# EAGLE design cek pin 37 (EAGLE 9.6.2)
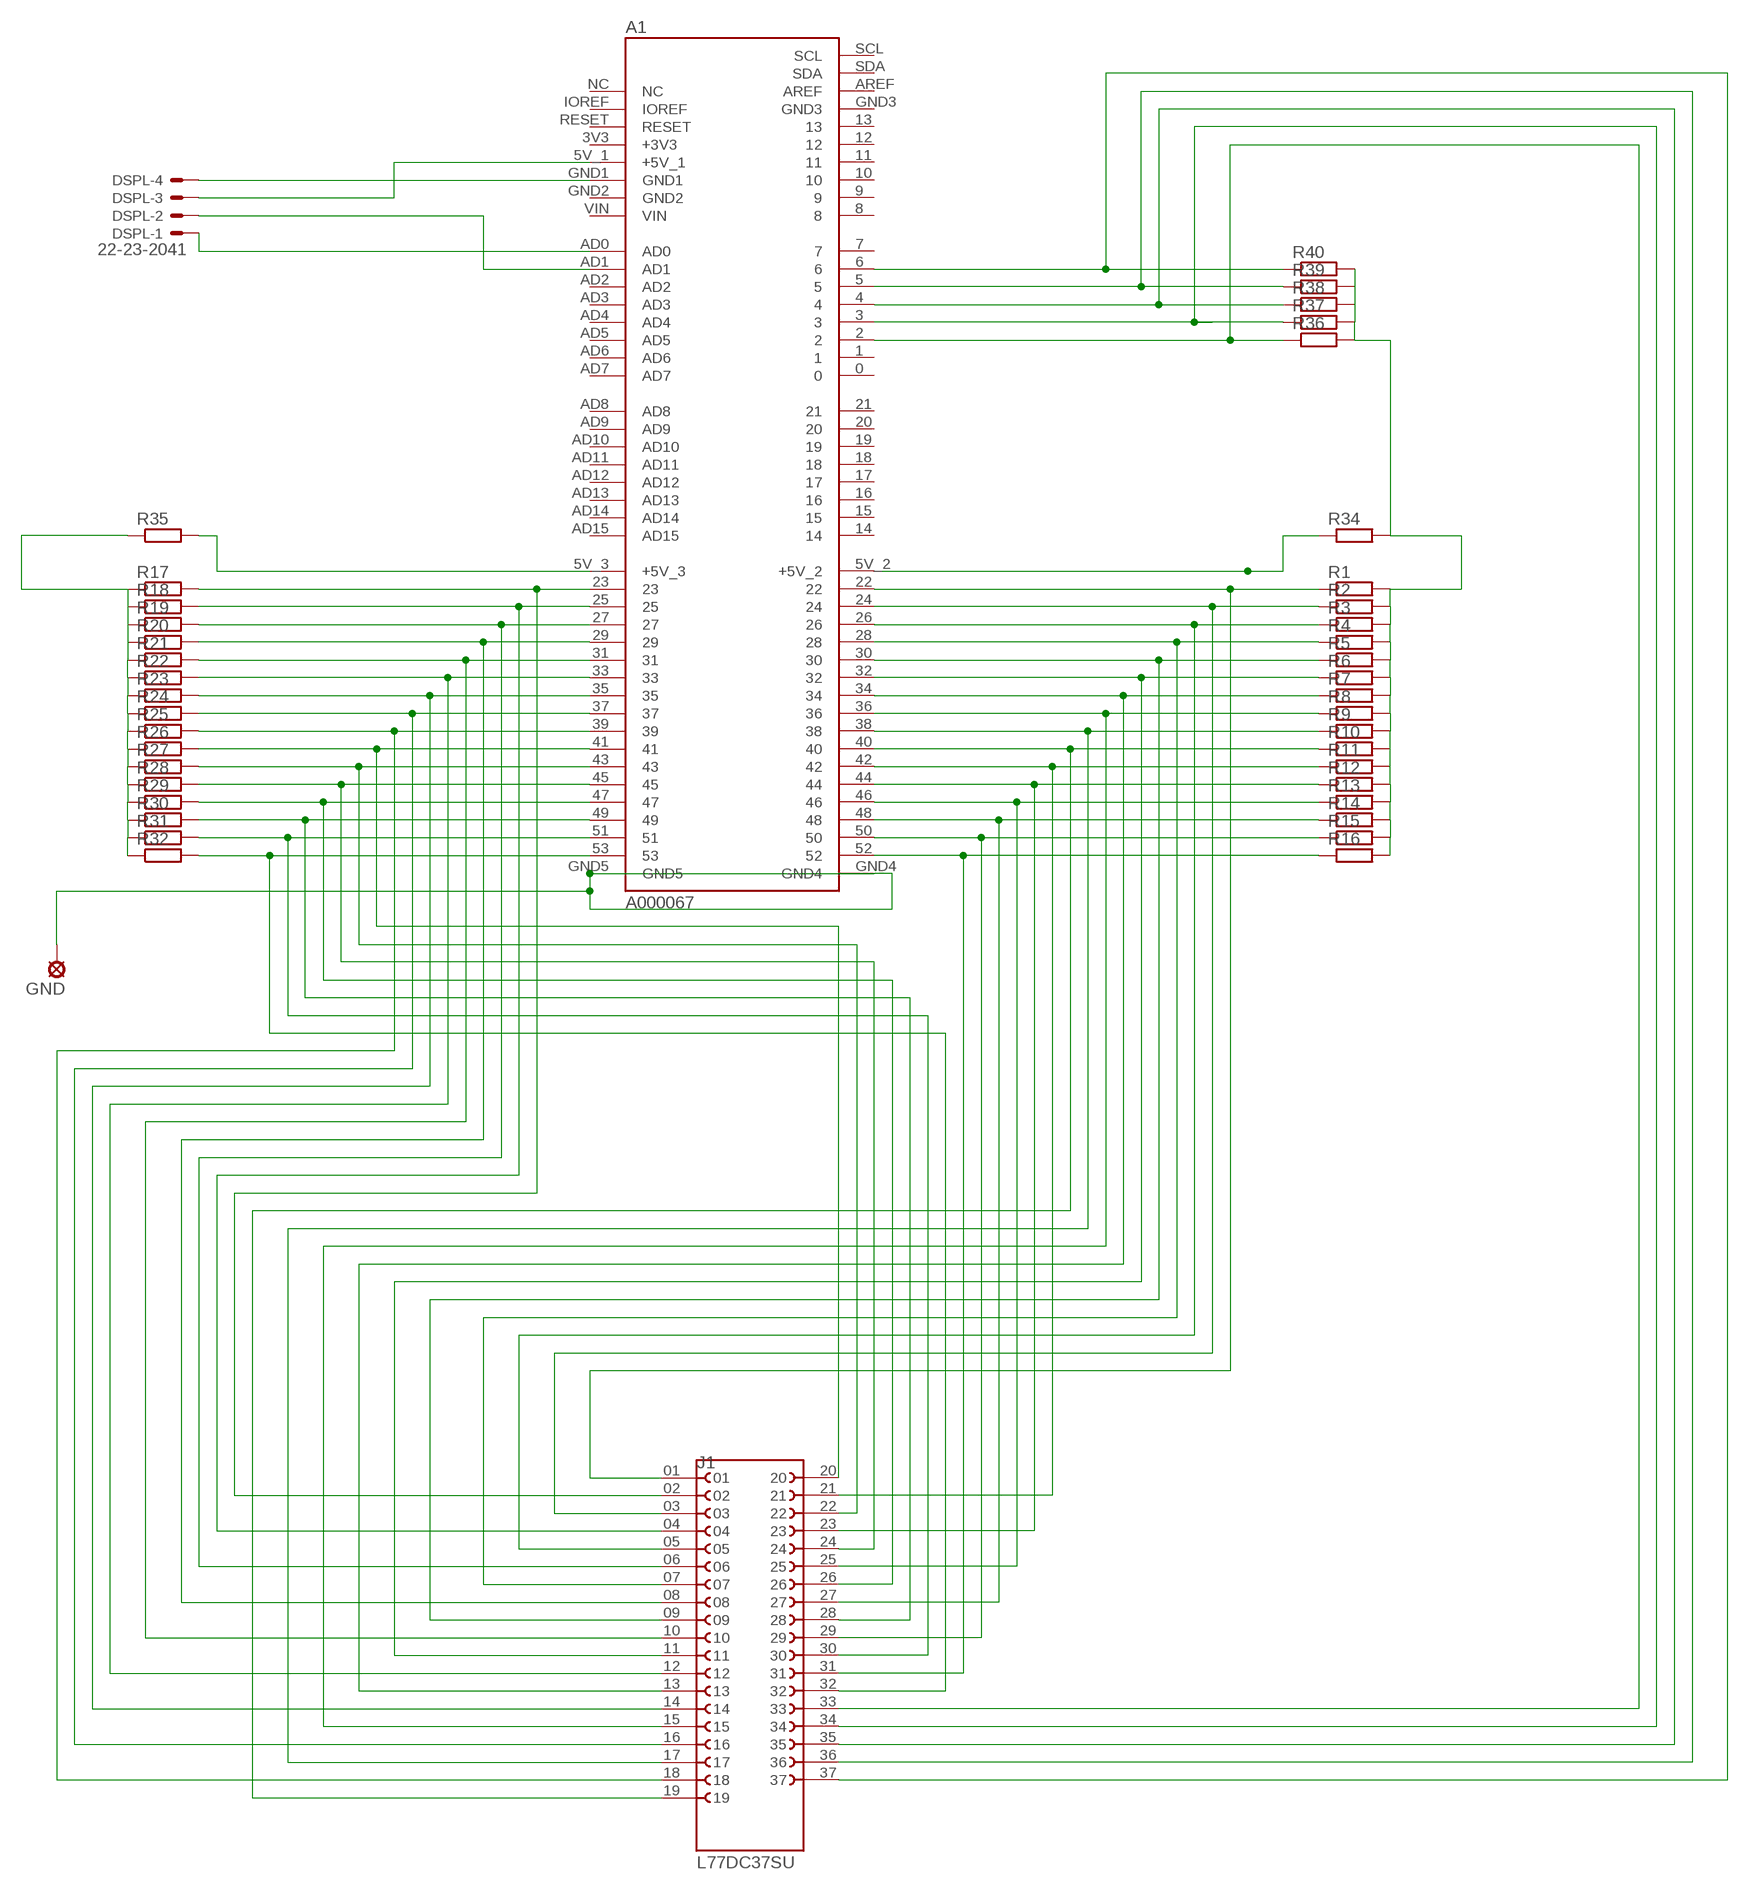
[diagram p0: schematic, sheet 1]

## Parts
A1  A000067  [ARDUINO_A000067]
DSPL  22-23-2041  [22-23-2041]
GND  LSP10  [LSP10]
J1  L77DC37SU  [AMPHENOL_L77DC37SU]
R1  R-EU_0207/12  [0207/12]
R2  R-EU_0207/12  [0207/12]
R3  R-EU_0207/12  [0207/12]
R4  R-EU_0207/12  [0207/12]
R5  R-EU_0207/12  [0207/12]
R6  R-EU_0207/12  [0207/12]
R7  R-EU_0207/12  [0207/12]
R8  R-EU_0207/12  [0207/12]
R9  R-EU_0207/12  [0207/12]
R10  R-EU_0207/12  [0207/12]
R11  R-EU_0207/12  [0207/12]
R12  R-EU_0207/12  [0207/12]
R13  R-EU_0207/12  [0207/12]
R14  R-EU_0207/12  [0207/12]
R15  R-EU_0207/12  [0207/12]
R16  R-EU_0207/12  [0207/12]
R17  R-EU_0207/12  [0207/12]
R18  R-EU_0207/12  [0207/12]
R19  R-EU_0207/12  [0207/12]
R20  R-EU_0207/12  [0207/12]
R21  R-EU_0207/12  [0207/12]
R22  R-EU_0207/12  [0207/12]
R23  R-EU_0207/12  [0207/12]
R24  R-EU_0207/12  [0207/12]
R25  R-EU_0207/12  [0207/12]
R26  R-EU_0207/12  [0207/12]
R27  R-EU_0207/12  [0207/12]
R28  R-EU_0207/12  [0207/12]
R29  R-EU_0207/12  [0207/12]
R30  R-EU_0207/12  [0207/12]
R31  R-EU_0207/12  [0207/12]
R32  R-EU_0207/12  [0207/12]
R34  R-EU_0207/12  [0207/12]
R35  R-EU_0207/12  [0207/12]
R36  R-EU_0207/12  [0207/12]
R37  R-EU_0207/12  [0207/12]
R38  R-EU_0207/12  [0207/12]
R39  R-EU_0207/12  [0207/12]
R40  R-EU_0207/12  [0207/12]

## Nets
N$1: A1.23 J1.02 R17.2
N$2: A1.25 J1.04 R18.2
N$3: A1.27 J1.06 R19.2
N$4: A1.29 J1.08 R20.2
N$5: A1.31 J1.10 R21.2
N$6: A1.33 J1.12 R22.2
N$7: A1.35 J1.14 R23.2
N$8: A1.37 J1.16 R24.2
N$9: A1.39 J1.18 R25.2
N$10: A1.41 J1.20 R26.2
N$11: A1.43 J1.22 R27.2
N$12: A1.45 J1.24 R28.2
N$13: A1.47 J1.26 R29.2
N$14: A1.49 J1.28 R30.2
N$15: A1.51 J1.30 R31.2
N$16: A1.53 J1.32 R32.2
N$17: A1.22 J1.01 R1.1
N$18: A1.24 J1.03 R2.1
N$19: A1.26 J1.05 R3.1
N$20: A1.28 J1.07 R4.1
N$21: A1.30 J1.09 R5.1
N$22: A1.32 J1.11 R6.1
N$23: A1.34 J1.13 R7.1
N$24: A1.36 J1.15 R8.1
N$25: A1.5V_1(+5V_1) DSPL.3
N$26: A1.GND1 DSPL.4
N$27: A1.AD1 DSPL.2
N$28: A1.44 J1.23 R12.1
N$29: A1.46 J1.25 R13.1
N$30: A1.48 J1.27 R14.1
N$31: A1.50 J1.29 R15.1
N$32: A1.52 J1.31 R16.1
N$33: A1.38 J1.17 R9.1
N$34: A1.5V_3(+5V_3) R35.2
N$35: A1.2 J1.33 R36.1
N$36: A1.AD0 DSPL.1
N$37: A1.4 J1.35 R38.1
N$38: A1.5 J1.36 R39.1
N$39: A1.6 J1.37 R40.1
N$40: R1.2 R2.2 R3.2 R4.2 R5.2 R6.2 R7.2 R8.2 R9.2 R10.2 R11.2 R12.2 R13.2 R14.2 R15.2 R16.2 R34.2 R36.2 R37.2 R38.2 R39.2 R40.2
N$41: R17.1 R18.1 R19.1 R20.1 R21.1 R22.1 R23.1 R24.1 R25.1 R26.1 R27.1 R28.1 R29.1 R30.1 R31.1 R32.1 R35.1
N$42: A1.5V_2(+5V_2) R34.1
N$43: A1.40 J1.19 R10.1
N$44: A1.42 J1.21 R11.1
N$45: A1.GND4 A1.GND5 GND.MP
N$48: A1.3 J1.34 R37.1
Unconnected: A1.0 A1.1 A1.3V3(+3V3) A1.7 A1.8 A1.9 A1.10 A1.11 A1.12 A1.13 A1.14 A1.15 A1.16 A1.17 A1.18 A1.19 A1.20 A1.21 A1.AD2 A1.AD3 A1.AD4 A1.AD5 A1.AD6 A1.AD7 A1.AD8 A1.AD9 A1.AD10 A1.AD11 A1.AD12 A1.AD13 A1.AD14 A1.AD15 A1.AREF A1.GND2 A1.GND3 A1.IOREF A1.NC A1.RESET A1.SCL A1.SDA A1.VIN

## Library data of the parts
A1 = A000067:A000067: ARDUINO UNO REV3 DEVELOPMENT BOARD Check availability <https://pricing.snapeda.com/parts/Arduino%20Mega%202560%20Rev3/Arduino/view-part?ref=eda>; AVAILABILITY: In Stock; CHECK_PRICES: https://www.snapeda.com/parts/Arduino%20Mega%202560%20Rev3/Arduino/view-part/?ref=eda; DESCRIPTION: 8-bit board with 54 digital pins, 16 analog inputs, and 4 serial ports.; MF: Arduino; MP: Arduino Mega 2560 Rev3; PACKAGE: Non-Standard Arduino; PRICE: None; SNAPEDA_LINK: https://www.snapeda.com/parts/Arduino%20Mega%202560%20Rev3/Arduino/view-part/?ref=snap
DSPL = con-molex:22-23-2041: .100" (2.54mm) Center Header - 4 Pin; MF: MOLEX; MPN: 22-23-2041; OC_FARNELL: 1462920; OC_NEWARK: 38C0355
GND = solpad:LSP10: SOLDER PAD drill 1.0 mm, distributor Buerklin, 12H555
J1 = L77DC37SU:L77DC37SU: Check availability <https://pricing.snapeda.com/parts/L77-DC37S-U/Amphenol%20Commercial%20Products/view-part?ref=eda>; AVAILABILITY: In Stock; CHECK_PRICES: https://www.snapeda.com/parts/L77-DC37S-U/Amphenol/view-part/?ref=eda; DESCRIPTION: Connector d-sub pcb dip solder 0.024 dia pcb cont 37 socket contact receptacle | Amphenol Commercial (Amphenol CS) L77-DC37S-U; MF: Amphenol Commercial Products; MP: L77-DC37S-U; PACKAGE: None; PRICE: None; SNAPEDA_LINK: https://www.snapeda.com/parts/L77-DC37S-U/Amphenol/view-part/?ref=snap
R1-R32 R34-R40 = rcl:R-EU_: RESISTOR, European symbol; SPICEPREFIX: R

## Board
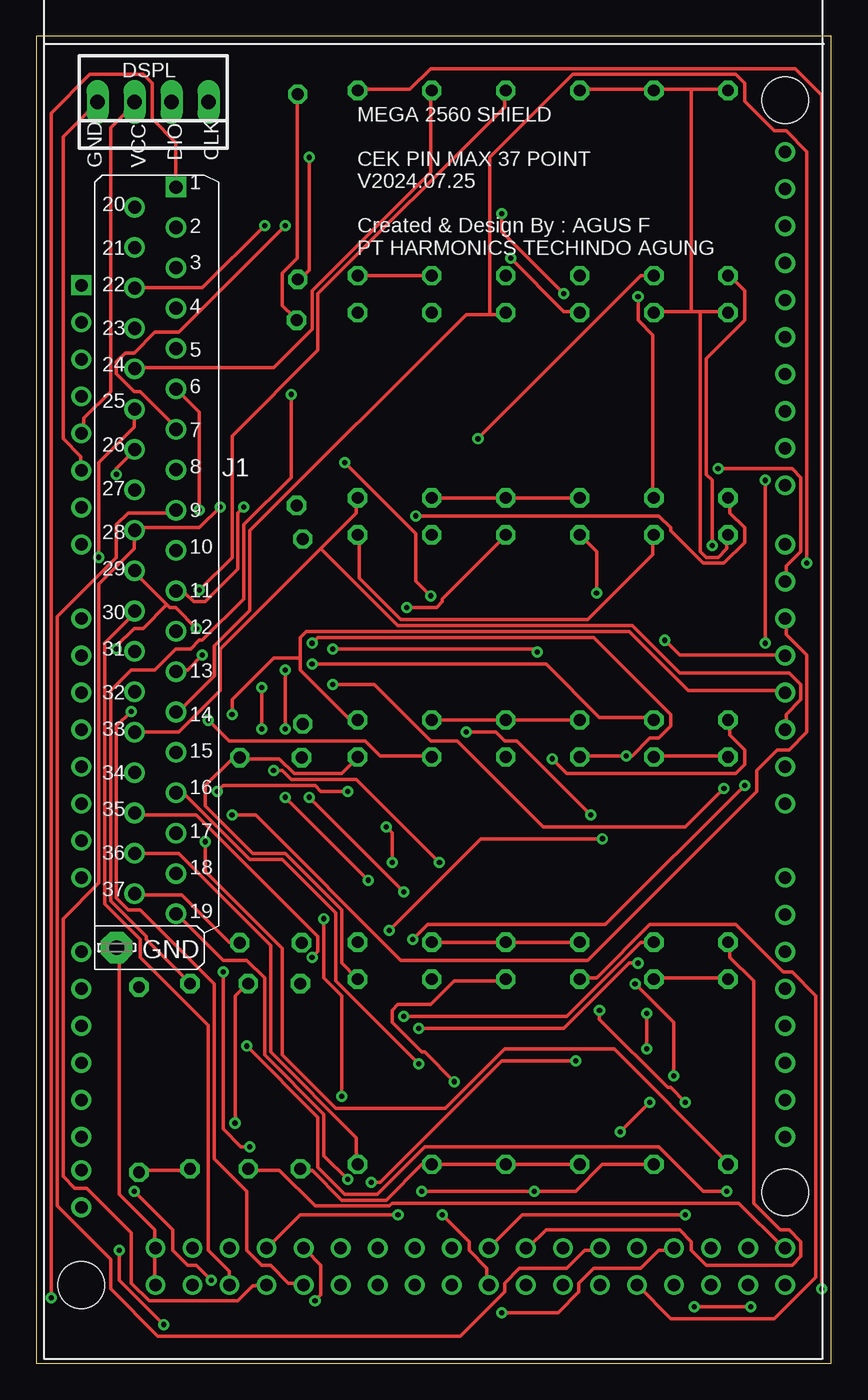
[diagram p1: board, top side]
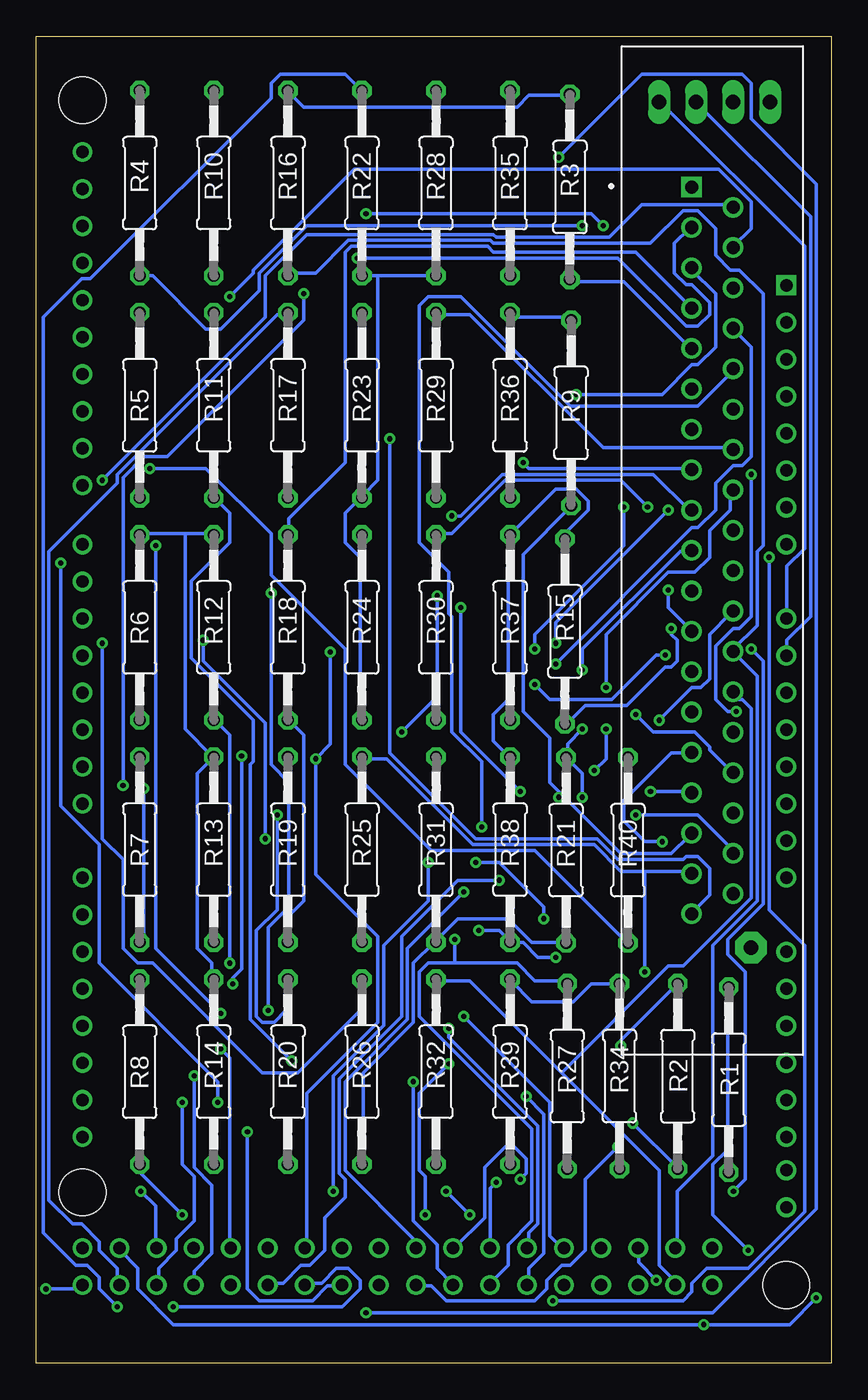
[diagram p2: board, bottom side, seen from below]

Size 54.5 x 91 mm. Coordinates in mm from the lower left corner, seen from the top.
Outline: 0,0 54.5,0 54.5,91 0,91 0,0
Copper layers (1*16): Top 0.035mm / dielectric 1.5mm / Bottom 0.035mm
Design rules "default *": minimum track width 10mil, minimum drill 0.35mm, track to track 6mil, track to pad 10mil, pad to pad 6mil, via to via 20mil, smd to smd 6mil, copper to edge 10mil, drill to drill 10mil, minimum pad ring 10mil, minimum via ring 8mil, stop-mask expansion 4mil, vias tented up to drill 0mil, thermal gap 10mil

### Footprints (pad centres in the part's own frame; a part is rotated, then mirrored left to right if it is on the bottom)
ARDUINO_A000067 = drill 0.85: 0 24.13,-12.7; 1 24.13,-10.16; 2 24.13,-7.62; 3 24.13,-5.08; 3V3 -24.13,15.24; 4 24.13,-2.54; 5 24.13,0; 5V_1 -24.13,12.7; 5V_2 24.13,-43.18; 5V_3 24.13,-45.72; 6 24.13,2.54; 7 24.13,5.08; 8 24.13,9.144; 9 24.13,11.684; 10 24.13,14.224; 11 24.13,16.764; 12 24.13,19.304; 13 24.13,21.844; 14 24.13,-17.78; 15 24.13,-20.32; 16 24.13,-22.86; 17 24.13,-25.4; 18 24.13,-27.94; 19 24.13,-30.48; 20 24.13,-33.02; 21 24.13,-35.56; 22 21.59,-43.18; 23 21.59,-45.72; 24 19.05,-43.18; 25 19.05,-45.72; 26 16.51,-43.18; 27 16.51,-45.72; 28 13.97,-43.18; 29 13.97,-45.72; 30 11.43,-43.18; 31 11.43,-45.72; 32 8.89,-43.18; 33 8.89,-45.72; 34 6.35,-43.18; 35 6.35,-45.72; 36 3.81,-43.18; 37 3.81,-45.72; 38 1.27,-43.18; 39 1.27,-45.72; 40 -1.27,-43.18; 41 -1.27,-45.72; 42 -3.81,-43.18; 43 -3.81,-45.72; 44 -6.35,-43.18; 45 -6.35,-45.72; 46 -8.89,-43.18; 47 -8.89,-45.72; 48 -11.43,-43.18; 49 -11.43,-45.72; 50 -13.97,-43.18; 51 -13.97,-45.72; 52 -16.51,-43.18; 53 -16.51,-45.72; AD0 -24.13,0; AD1 -24.13,-2.54; AD2 -24.13,-5.08; AD3 -24.13,-7.62; AD4 -24.13,-10.16; AD5 -24.13,-12.7; AD6 -24.13,-15.24; AD7 -24.13,-17.78; AD8 -24.13,-22.86; AD9 -24.13,-25.4; AD10 -24.13,-27.94; AD11 -24.13,-30.48; AD12 -24.13,-33.02; AD13 -24.13,-35.56; AD14 -24.13,-37.846; AD15 -24.13,-40.386; AREF 24.13,26.924; GND1 -24.13,10.16; GND2 -24.13,7.62; GND3 24.13,24.384; GND4 -19.05,-43.18; GND5 -19.05,-45.72; IOREF -24.13,20.32; RESET -24.13,17.78; SCL 24.13,32.004; SDA 24.13,29.464; VIN -24.13,5.08 | drill 0.85 square: NC -24.13,22.86 | hole 3.2: 24.13,35.56; -24.13,-45.72; 24.13,-39.37
22-23-2041 = drill 1 long: 1 -3.81,0; 2 -1.27,0; 3 1.27,0; 4 3.81,0
LSP10 = drill 1.016 pad 2.159 octagon: MP 0,0
AMPHENOL_L77DC37SU = drill 0.9 square: 01 24.93,1.42 | drill 0.9: 02 22.16,1.42; 03 19.39,1.42; 04 16.62,1.42; 05 13.85,1.42; 06 11.08,1.42; 07 8.31,1.42; 08 5.54,1.42; 09 2.77,1.42; 10 0,1.42; 11 -2.77,1.42; 12 -5.54,1.42; 13 -8.31,1.42; 14 -11.08,1.42; 15 -13.85,1.42; 16 -16.62,1.42; 17 -19.39,1.42; 18 -22.16,1.42; 19 -24.93,1.42; 20 23.545,-1.42; 21 20.775,-1.42; 22 18.005,-1.42; 23 15.235,-1.42; 24 12.465,-1.42; 25 9.695,-1.42; 26 6.925,-1.42; 27 4.155,-1.42; 28 1.385,-1.42; 29 -1.385,-1.42; 30 -4.155,-1.42; 31 -6.925,-1.42; 32 -9.695,-1.42; 33 -12.465,-1.42; 34 -15.235,-1.42; 35 -18.005,-1.42; 36 -20.775,-1.42; 37 -23.545,-1.42
0207/12 = drill 0.813 octagon: 1 -6.35,0; 2 6.35,0

### Placement (x,y rotation side)
A1  27.21,51.07 0 top
DSPL  8,86.5 180 top
GND  5.5,28.5 0 top
J1  8.15,55.74 90 bottom
R1  7.03,19.44 270 bottom
R2  10.53,19.68 270 bottom
R3  17.92,80.68 90 bottom
R4  47.42,80.94 90 bottom
R5  47.42,65.7 90 bottom
R6  47.42,50.46 90 bottom
R7  47.42,35.22 90 bottom
R8  47.42,19.98 90 bottom
R9  17.84,65.18 90 bottom
R10  42.34,80.94 90 bottom
R11  42.34,65.7 90 bottom
R12  42.34,50.46 90 bottom
R13  42.34,35.22 90 bottom
R14  42.34,19.98 90 bottom
R15  18.26,50.18 90 bottom
R16  37.26,80.94 90 bottom
R17  37.26,65.7 90 bottom
R18  37.26,50.46 90 bottom
R19  37.26,35.22 90 bottom
R20  37.26,19.98 90 bottom
R21  18.18,35.18 90 bottom
R22  32.18,80.94 90 bottom
R23  32.18,65.7 90 bottom
R24  32.18,50.46 90 bottom
R25  32.18,35.22 90 bottom
R26  32.18,19.98 90 bottom
R27  18.1,19.68 90 bottom
R28  27.1,80.94 90 bottom
R29  27.1,65.7 90 bottom
R30  27.1,50.46 90 bottom
R31  27.1,35.22 90 bottom
R32  27.1,19.98 90 bottom
R34  14.52,19.68 90 bottom
R35  22.02,80.94 90 bottom
R36  22.02,65.7 90 bottom
R37  22.02,50.46 90 bottom
R38  22.02,35.22 90 bottom
R39  22.02,19.98 90 bottom
R40  13.94,35.18 90 bottom

### Tracks (layer width: path | path; a pad name or v marks a point on that pad's centre or on a via)
N$1  (via drill 0.35)
  Top 0.254: v32.51,75.79 36.17,72.14 37.19,72.14 R17.2
  Bottom 0.254: v32.51,75.79 14.63,75.79 9.96,71.12 9.14,71.12 8.33,71.93 8.33,72.75 9.55,73.97 9.96,73.97 10.77,74.78 10.77,76.81 9.75,77.83 J1.02 | A1.23 48.97,5.49 48.97,6.5 50.19,7.72 50.19,8.33 51.41,9.55 52.02,9.55 53.65,11.18 53.65,55.68 48.97,60.35 48.97,60.96 38,71.93 37.39,71.93 R17.2
N$2  (via drill 0.35)
  Top 0.254: v44.5,17.88 43.48,18.9 43.28,18.9 38.61,23.57 v38.61,24.18 | v38.41,52.83 38.41,55.68 37.39,56.69 R18.2
  Bottom 0.254: R18.2 37.19,56.9 37.19,57.91 33.33,61.77 33.33,76.2 32.92,76.61 23.57,76.61 23.16,76.2 13.41,76.2 9.75,72.54 J1.04 | v44.5,17.88 44.5,13.61 43.69,12.8 43.69,9.75 44.91,8.53 44.91,7.72 46.13,6.5 46.13,5.49 A1.25 | v38.61,24.18 38.61,29.87 37.19,31.29 37.19,39.83 38.41,41.05 v38.41,52.83
N$3  (via drill 0.35)
  Top 0.254: v18.9,49.38 19.3,49.78 38.2,49.78 43.48,44.5 43.48,43.69 42.67,42.88 42.06,42.88 40.84,41.66 v40.44,41.66 37.39,41.66 R19.2 | v11.18,58.52 11.18,65.23 9.75,66.65 J1.06 | v43.69,19.71 43.69,23.37 v41.05,26.01
  Bottom 0.254: v18.9,49.38 18.9,50.8 v11.18,58.52 | v43.69,19.71 43.69,13.41 42.47,12.19 42.47,7.52 43.69,6.3 43.69,5.49 A1.27 | v41.05,26.01 41.05,26.42 40.44,27.03 v40.44,41.66
N$4  (via drill 0.35)
  Top 0.254: R20.2 37.39,26.42 38.41,26.42 42.06,30.07 47.95,30.07 51.21,26.82 51.82,26.82 53.44,25.2 53.44,5.89 50.6,3.05 43.48,3.05 41.25,5.28 A1.29 | v21.13,61.77 26.01,56.9 26.01,53.65 v27.03,52.63 | v29.46,43.28 31.5,43.28 32.11,42.67 32.92,42.67 v38,37.59
  Bottom 0.254: v21.13,61.77 20.73,61.37 9.75,61.37 J1.08 | v27.03,52.63 27.03,45.72 v29.46,43.28 | v38,37.59 38,31.09 39.42,29.67 39.42,23.77 39.01,23.37 38.2,23.37 37.39,24.18 37.39,26.21 R20.2
N$5  (via drill 0.35)
  Top 0.254: v17.07,47.55 v17.07,43.48 | v17.07,38.81 v22.76,33.12
  Bottom 0.254: v17.07,43.48 18.09,42.47 18.09,41.66 R21.2 18.09,41.45 17.07,40.44 v17.07,38.81 | v17.07,47.55 17.07,48.97 10.36,55.68 9.75,55.68 J1.10 | v22.76,33.12 25.6,33.12 29.46,29.26 29.46,23.77 33.73,19.51 33.73,13.01 33.33,12.6 33.33,11.38 34.75,9.96 34.75,7.72 35.76,6.71 36.37,6.71 37.59,5.49 38.61,5.49 A1.31
N$6  (via drill 0.35)
  Top 0.254: v11.18,53.03 13.41,55.27 13.41,63.6 19.3,69.49 19.3,73.36 32.11,86.16 32.11,87.17 R22.2 | v48.97,3.86 v45.11,3.86
  Bottom 0.254: v11.18,53.03 11.18,51.82 9.75,50.39 J1.12 | v45.11,3.86 33.53,3.86 32.31,5.08 32.31,5.69 33.12,6.5 33.93,6.5 34.95,5.49 35.97,5.49 A1.33 | v48.97,3.86 50.19,5.08 50.19,5.89 51,6.71 51.82,6.71 54.05,8.94 54.05,71.73 51.41,74.37 50.8,74.37 38.41,86.77 38.41,87.78 37.8,88.39 33.33,88.39 32.31,87.38 R22.2
N$7  (via drill 0.35)
  Top 0.254: 31.09,71.93 29.46,71.93 14.63,57.1 14.63,51.61 12.19,49.17 12.19,47.14 9.75,44.7 J1.14 | 31.09,71.93 32.11,71.93 R23.2 | v42.06,17.88 v40.03,15.85 | v52.83,54.86 52.83,83.11 51.41,84.53 50.6,84.53 48.56,86.56 48.56,87.78 47.95,88.39 36.78,88.39 31.09,82.7 31.09,71.93
  Bottom 0.254: v40.03,15.85 40.03,5.08 39.22,4.27 35.56,4.27 34.54,5.28 33.73,5.28 A1.35 | v42.06,17.88 42.06,19.3 50.19,27.43 50.19,35.56 52.83,38.2 v52.83,54.86
N$8  (via drill 0.35)
  Top 0.254: v25.4,51.82 27.43,51.82 27.84,52.22 27.84,52.43 32.11,56.69 R24.2 | v21.34,39.22 19.51,39.22 19.1,39.62 12.8,39.62 v12.39,39.22 | v27.84,10.16 29.67,8.33 29.67,7.72 30.89,6.5 30.89,5.49 A1.37 | v26.21,20.52 20.52,26.21 20.52,30.89 16.87,34.54 14.63,34.54 10.16,39.01 9.75,39.01 J1.16
  Bottom 0.254: v25.4,51.82 25.4,43.28 v21.34,39.22 | v12.39,39.22 9.75,39.22 J1.16 | v27.84,10.16 27.84,12.8 28.25,13.21 28.25,18.49 v26.21,20.52
N$9  (via drill 0.35)
  Top 0.254: v14.63,14.83 14.02,14.83 12.8,16.05 v12.8,26.82
  Bottom 0.254: 12.8,33.73 9.75,33.73 J1.18 | 12.8,33.73 14.43,33.73 16.26,35.56 24.59,35.56 30.48,41.45 32.11,41.45 R25.2 | v14.63,14.83 16.87,12.6 16.87,7.72 17.88,6.71 18.49,6.71 19.51,5.69 19.51,5.08 20.32,4.27 26.42,4.27 27.43,5.28 28.45,5.28 A1.39 | 12.8,33.73 v12.8,26.82
N$10  (via drill 0.35)
  Top 0.254: v28.65,19.3 26.62,21.34 26.42,21.34 24.38,23.37 24.38,24.18 24.79,24.59 27.03,24.59 28.65,26.21 32.11,26.21 R26.2 | v49.99,49.38 v49.99,60.55
  Bottom 0.254: v28.65,19.3 28.65,9.75 27.03,8.13 27.03,6.5 26.01,5.49 A1.41 | v49.99,60.55 38.81,71.73 38.81,74.57 35.97,77.42 23.16,77.42 22.96,77.22 15.24,77.22 13.01,79.45 6.91,79.45 J1.20 | v49.99,49.38 49.99,35.97 48.56,34.54 48.56,28.45 47.55,27.43 46.53,27.43 39.01,19.91 36.58,19.91 32.31,24.18 32.31,26.21 R26.2
N$11  (via drill 0.35)
  Top 0.254: v15.65,78.03 11.38,73.76 6.91,73.76 J1.22 | v31.9,78.84 31.9,77.62 v36.17,73.36 | v48.56,39.62 39.01,30.07 26.82,30.07 v25.81,29.06
  Bottom 0.254: 25.81,27.43 27.64,27.43 28.25,26.82 28.25,23.77 20.52,16.05 20.52,9.75 22.15,8.13 22.15,6.71 23.37,5.49 A1.43 | 25.81,27.43 21.54,27.43 20.32,26.21 18.29,26.21 R27.2 | v15.65,78.03 16.46,78.84 v31.9,78.84 | v36.17,73.36 36.17,71.53 45.52,62.18 47.14,62.18 48.56,60.76 v48.56,39.62 | 25.81,27.43 v25.81,29.06
N$12  (via drill 0.35)
  Top 0.254: R28.2 27.03,87.17 27.03,81.69 18.9,73.56 18.9,70.92 16.26,68.28 6.91,68.28 J1.24 | v20.93,18.29 20.93,25.2 19.71,26.42 v19.71,30.48 | v24.38,34.34 24.38,36.37 v23.98,36.78
  Bottom 0.254: v20.93,18.29 19.71,17.07 19.71,7.52 20.73,6.5 20.73,5.49 A1.45 | v19.71,30.48 19.71,31.29 22.76,34.34 v24.38,34.34 | v23.98,36.78 23.98,41.25 26.01,43.28 26.01,51.21 26.21,51.41 26.21,54.25 28.25,56.29 28.25,72.54 27.64,73.15 25.4,73.15 17.88,65.63 9.14,65.63 6.71,68.07 J1.24
N$13  (via drill 0.35)
  Top 0.254: v6.5,44.7 5.49,43.69 5.49,31.9 6.3,31.09 7.11,31.09 12.19,26.01 12.19,14.02 14.43,11.79 14.43,7.72 15.44,6.71 16.05,6.71 17.27,5.49 18.29,5.49 A1.47 | v5.49,60.96 5.49,61.37 6.71,62.59 J1.26
  Bottom 0.254: R29.2 27.03,71.93 24.79,71.93 15.65,62.79 6.91,62.79 J1.26 | v6.5,44.7 7.11,44.7 7.92,45.52 7.92,49.17 6.71,50.39 6.3,50.39 5.49,51.21 v5.49,60.96
N$14  (via drill 0.35)
  Top 0.254: v12.6,58.73 11.18,57.3 6.91,57.3 J1.28 6.71,57.1 6.71,55.88 4.27,53.44 4.27,32.92 1.83,30.48 1.83,12.8 2.64,11.99 3.45,11.99 6.5,8.94 6.5,5.49 7.72,4.27 13.82,4.27 14.83,5.28 15.65,5.28 A1.49
  Bottom 0.254: v12.6,58.73 14.43,60.55 22.35,60.55 26.01,56.9 27.03,56.9 R30.2
N$15  (via drill 0.35)
  Top 0.254: v11.79,44.09 13.21,42.67 22.55,42.67 23.57,41.66 27.03,41.66 R31.2 | A1.51 13.21,5.49 13.21,6.3 11.79,7.72 11.79,23.16 7.11,27.84 7.11,29.06 4.67,31.5 4.67,49.38 6.71,51.41 J1.30
  Bottom 0.254: v11.79,44.09 9.55,46.33 8.94,46.33 8.33,46.94 8.33,49.99 6.91,51.41 J1.30
N$16
  Bottom 0.254: 18.49,19.91 11.79,13.21 11.79,6.71 10.57,5.49 A1.53 | 18.49,19.91 24.79,26.21 27.03,26.21 R32.2 | 18.49,19.91 11.18,27.23 10.16,27.23 5.49,31.9 5.49,44.91 6.1,45.52 6.3,45.52 6.71,45.92 J1.32
N$17  (via drill 0.35)
  Top 0.254: v5.69,7.72 5.69,5.69 v8.74,2.64 | v1.02,4.47 1.02,85.75 3.66,88.39 7.32,88.39 7.92,87.78 7.92,85.34 9.55,83.72 9.55,80.67 J1.01
  Bottom 0.254: v5.69,7.72 8.13,10.16 8.13,13.61 7.11,14.63 7.11,25.6 R1.1 | A1.22 48.77,7.72 47.55,6.5 47.55,5.08 45.11,2.64 v8.74,2.64 2.85,2.64 v1.02,4.47
N$18  (via drill 0.35)
  Top 0.254: v17.48,66.45 17.48,60.76 14.22,57.51 14.22,52.43 11.38,49.58 11.18,49.58 10.57,48.97 9.55,48.97 8.13,47.55 6.5,47.55 5.08,46.13 5.08,31.7 7.52,29.26 7.52,29.06 10.36,26.21 R2.1 | v47.35,11.79 45.72,11.79 42.67,14.83 26.62,14.83 23.37,11.58 21.13,11.58 19.3,13.41 19.3,16.87 v14.43,21.74
  Bottom 0.254: v17.48,66.45 11.58,66.45 9.55,68.48 9.14,68.48 7.92,69.7 7.92,73.36 9.55,74.98 J1.03 | v47.35,11.79 46.33,10.77 46.33,7.92 A1.24 | v14.43,21.74 14.43,22.15 10.57,26.01 R2.1
N$19  (via drill 0.35)
  Top 0.254: v31.9,3.45 35.76,3.45 37.19,4.88 37.19,5.49 38.2,6.5 41.45,6.5 42.67,7.72 43.69,7.72 A1.26 | v18.69,82.7 18.69,74.98 18.09,74.37 R3.1
  Bottom 0.254: R3.1 17.88,74.17 14.22,74.17 9.75,69.7 J1.05 | v31.9,3.45 8.13,3.45 1.02,10.57 1.02,80.87 5.49,85.34 5.49,87.78 6.1,88.39 13.01,88.39 v18.69,82.7
N$20  (via drill 0.35)
  Top 0.254: v17.07,78.03 9.75,70.71 8.13,70.71 6.71,69.29 6.1,69.29 5.49,68.68 5.49,67.87 6.71,66.65 7.11,66.65 9.55,64.21 J1.07 | v41.86,23.98 v41.86,21.54 | v46.33,56.08 46.33,60.55 45.92,60.96 45.92,68.89 48.56,71.53 48.56,73.56 47.55,74.57 R4.1
  Bottom 0.254: v17.07,78.03 35.97,78.03 39.22,74.78 39.22,73.56 41.86,70.92 42.88,70.92 46.53,74.57 47.35,74.57 R4.1 | v41.86,21.54 41.25,20.93 41.25,7.92 A1.28 | v41.86,23.98 46.33,28.45 v46.33,56.08
N$21  (via drill 0.35)
  Top 0.254: v26.01,58.12 42.67,58.12 43.48,57.3 43.48,57.1 45.72,54.86 47.14,54.86 48.56,56.29 48.56,57.3 47.55,58.32 47.55,59.33 R5.1 | A1.30 38.61,7.72 37.59,7.72 36.37,6.5 33.12,6.5 32.11,5.49 32.11,4.88 29.06,1.83 8.33,1.83 5.08,5.08 5.08,7.11 1.42,10.77 1.42,51.21 5.49,55.27 5.49,57.51 6.3,58.32 9.55,58.32 J1.09
  Bottom 0.254: v26.01,58.12 25.4,58.12 22.55,60.96 12.19,60.96 9.75,58.52 J1.09
N$22  (via drill 0.35)
  Top 0.254: v35.36,41.45 36.37,40.44 47.95,40.44 48.56,41.05 48.56,42.06 47.55,43.08 47.55,44.09 R6.1 | v14.22,58.73 13.82,58.32 13.82,54.46 11.58,52.22 10.77,52.22 10.16,52.83 9.75,52.83 J1.11 | v20.32,48.97 34.14,48.97 v34.34,48.77
  Bottom 0.254: A1.32 35.97,7.92 35.97,18.49 31.09,23.37 31.09,29.26 35.36,33.53 v35.36,41.45 34.34,42.47 v34.34,48.77 | v14.22,58.73 14.22,56.08 20.32,49.99 v20.32,48.97
N$23  (via drill 0.35)
  Top 0.254: R7.1 47.55,28.85 47.55,27.84 49.17,26.21 49.17,10.97 51,9.14 51.61,9.14 52.43,8.33 52.43,7.32 51.82,6.71 45.92,6.71 44.91,7.72 44.91,8.33 44.09,9.14 34.95,9.14 33.73,7.92 A1.34 | v11.38,48.56 10.36,47.55 9.75,47.55 J1.13 | v20.32,46.53 23.16,46.53 27.03,42.67 28.85,42.67 34.75,36.78 44.5,36.78 v47.14,39.42
  Bottom 0.254: v11.38,48.56 11.99,48.56 15.04,45.52 19.3,45.52 v20.32,46.53 | v47.14,39.42 47.14,29.26 47.35,29.06 R7.1
N$24  (via drill 0.35)
  Top 0.254: v44.5,10.16 33.33,10.16 31.09,7.92 A1.36 | v11.58,35.76 11.58,33.73 16.87,28.45 16.87,21.13 20.52,17.48 28.04,17.48 32.11,21.54 39.62,21.54 47.35,13.82 R8.1
  Bottom 0.254: v44.5,10.16 47.35,13.01 47.35,13.61 R8.1 | v11.58,35.76 12.8,35.76 14.22,37.19 14.22,38.61 10.97,41.86 9.75,41.86 J1.15
N$25
  Top 0.254: A1.5V_1 3.25,63.8 3.25,64.82 5.08,66.65 5.08,84.73 6.71,86.36 DSPL.3
N$26
  Top 0.254: A1.GND1 3.05,61.37 3.05,62.18 1.83,63.4 1.83,84.12 4.06,86.36 DSPL.4
N$27
  Bottom 0.254: A1.AD1 3.05,48.56 3.05,49.58 1.42,51.21 1.42,78.64 9.14,86.36 DSPL.2
N$28  (via drill 0.35)
  Top 0.254: v18.9,47.95 34.95,47.95 38.61,44.3 42.27,44.3 R12.1 | v26.21,22.96 36.17,22.96 40.64,27.43 v41.25,27.43
  Bottom 0.254: v18.9,47.95 9.55,57.3 9.14,57.3 7.92,58.52 7.92,60.35 6.71,61.57 6.1,61.57 5.49,62.18 5.49,69.7 6.71,70.92 J1.23 | v26.21,22.96 26.21,22.35 20.12,16.26 20.12,9.55 20.73,8.94 20.73,7.92 A1.44 | v41.25,27.43 41.25,43.08 42.27,44.09 R12.1
N$29  (via drill 0.35)
  Top 0.254: v25.2,23.77 36.37,23.77 41.45,28.85 42.27,28.85 R13.1 | v4.27,55.27 4.27,61.77 6.71,64.21 6.71,65.43 J1.25 | v19.1,4.27 19.51,4.67 19.51,6.71 18.49,7.72 A1.46
  Bottom 0.254: v25.2,23.77 19.3,17.88 19.3,8.74 18.49,7.92 A1.46 | v4.27,55.27 4.27,31.09 1.83,28.65 1.83,10.36 5.69,6.5 8.53,6.5 9.55,5.49 9.55,4.88 10.16,4.27 v19.1,4.27
N$30  (via drill 0.35)
  Top 0.254: v26.42,11.79 v34.14,11.79 36.98,11.79 38.81,13.61 42.27,13.61 R14.1 | v24.79,10.16 18.09,10.16 15.85,7.92 A1.48 | v15.44,43.48 v15.44,46.33 | v16.26,40.64 16.87,40.64 17.48,40.03 21.95,40.03 v27.64,34.34
  Bottom 0.254: v24.79,10.16 v26.42,11.79 | v15.44,46.33 15.44,49.99 11.18,54.25 9.35,54.25 8.33,55.27 8.33,57.1 6.91,58.52 6.91,59.74 J1.27 | v15.44,43.48 15.44,41.45 v16.26,40.64 | v27.64,34.34 27.64,31.7 30.68,28.65 30.68,23.16 34.14,19.71 v34.14,11.79
N$31  (via drill 0.35)
  Top 0.254: v10.97,50.39 9.55,51.82 9.14,51.82 8.94,52.02 | 8.94,52.02 6.71,54.25 J1.29 | v11.99,5.69 10.97,6.71 10.36,6.71 9.35,7.72 9.35,9.14 v6.71,11.79 | v5.49,48.97 5.49,49.17 6.71,50.39 7.32,50.39 8.94,52.02
  Bottom 0.254: v10.97,50.39 10.97,49.99 10.57,49.58 10.57,48.16 10.97,47.75 11.38,47.75 14.02,45.11 16.87,45.11 18.09,43.89 R15.1 | v11.99,5.69 13.21,6.91 13.21,7.72 A1.50 | v6.71,11.79 5.89,12.6 5.89,26.82 7.11,28.04 7.11,29.06 4.67,31.5 4.67,48.16 v5.49,48.97
N$32
  Bottom 0.254: R16.1 37.19,74.78 35.36,74.78 33.12,77.01 23.37,77.01 23.16,76.81 12.39,76.81 10.16,79.05 9.14,79.05 7.92,77.83 7.92,76 6.91,74.98 6.3,74.98 4.67,73.36 4.67,56.08 5.08,55.68 5.08,50.6 6.71,48.97 J1.31 6.71,48.77 5.08,47.14 5.08,31.7 8.13,28.65 8.13,14.22 10.57,11.79 10.57,7.92 A1.52
N$33  (via drill 0.35)
  Top 0.254: v18.69,38.81 v25.2,32.31
  Bottom 0.254: 18.49,39.01 14.43,34.95 10.97,34.95 9.75,36.17 J1.17 | 18.49,39.01 19.3,39.83 19.3,42.88 21.13,44.7 21.13,55.47 17.88,58.73 R9.1 | v25.2,32.31 29.06,28.45 29.06,23.57 33.33,19.3 33.33,13.21 28.65,8.53 28.65,7.92 A1.38 | 18.49,39.01 v18.69,38.81
N$34  (via drill 0.35)
  Top 0.254: v53.85,5.08 53.85,86.97 52.02,88.8 27.03,88.8 25.6,87.38 22.15,87.38 R35.2
  Bottom 0.254: v53.85,5.08 51.61,5.08 51.41,5.28 A1.5V_3
N$35
  Top 0.254: 19.51,55.88 12.6,48.97 12.6,46.13 9.75,43.28 6.91,43.28 J1.33 | 19.51,55.88 21.95,58.32 21.95,59.33 R36.1 | 19.51,55.88 24.79,50.6 40.84,50.6 44.09,47.35 51.61,47.35 52.43,46.53 52.43,45.52 51.41,44.5 51.41,43.48 A1.2
N$36
  Bottom 0.254: A1.AD0 3.05,51.21 3.05,54.66 1.83,55.88 1.83,76.61 11.79,86.56 DSPL.1
N$37  (via drill 0.35)
  Top 0.254: v18.9,27.84 19.3,28.25 19.3,29.26 10.97,37.59 6.91,37.59 J1.35 | v43.08,49.58 44.09,48.56 51.21,48.56 A1.4 | v38.81,35.97 30.48,35.97 v24.18,29.67
  Bottom 0.254: v18.9,27.84 20.12,27.84 21.13,28.85 21.95,28.85 R38.1 22.15,29.06 22.76,29.67 v24.18,29.67 | v43.08,49.58 43.08,48.16 38.81,43.89 v38.81,35.97
N$38  (via drill 0.35)
  Top 0.254: R39.1 21.95,13.82 21.95,15.44 16.05,21.34 16.05,28.65 9.75,34.95 6.91,34.95 J1.36 | v13.41,37.59 15.04,37.59 24.99,27.64 37.8,27.64 49.38,39.22 49.38,40.64 50.8,42.06 51.61,42.06 52.83,43.28 52.83,48.56 51.41,49.99 51.41,51 A1.5
  Bottom 0.254: v13.41,37.59 9.14,37.59 6.71,35.15 J1.36
N$39  (via drill 0.35)
  Top 0.254: R40.1 13.82,28.85 13.21,28.85 9.96,32.11 6.91,32.11 J1.37 | v46.74,61.37 51.82,61.37 52.43,60.76 52.43,55.68 51.41,54.66 51.41,53.65 A1.6
  Bottom 0.254: v46.74,61.37 42.88,61.37 38.41,56.9 38.41,54.05 33.33,48.97 33.33,41.05 27.43,35.15 20.32,35.15 14.02,28.85 R40.1
N$40  (via drill 0.35)
  Top 0.254: R38.2 21.95,41.45 20.93,40.44 17.68,40.44 16.66,41.45 14.02,41.45 R40.2 13.82,41.45 13.41,41.45 11.58,39.62 11.58,38.2 14.83,34.95 17.07,34.95 20.93,31.09 20.93,27.43 21.95,26.42 R39.2 | R1.2 7.11,13.21 10.36,13.21 R2.2 | v13.61,16.46 13.61,25.2 14.43,26.01 R34.2 | R14.2 42.47,26.42 47.35,26.42 R8.2 | R13.2 42.47,41.66 47.35,41.66 R7.2 | R3.2 17.88,86.97 17.88,75.79 16.87,74.78 16.87,72.54 17.68,71.73 R9.2 | 45.52,72.14 47.35,72.14 R5.2 | 45.52,72.14 44.91,72.14 | 44.91,72.14 42.47,72.14 R11.2 | R16.2 37.39,87.38 42.27,87.38 R10.2 42.47,87.38 44.91,87.38 | 44.91,87.38 47.35,87.38 R4.2 | 44.91,87.38 44.91,72.14 | 45.52,72.14 45.52,55.68 45.92,55.27 46.74,55.27 47.35,55.88 47.35,56.69 R6.2 | R37.2 22.15,56.69 22.15,53.85 24.99,51 37.8,51 42.27,55.47 42.27,56.69 R12.2
  Bottom 0.254: R15.2 18.09,56.69 18.09,57.1 16.66,58.52 16.66,59.13 17.48,59.94 18.9,59.94 21.95,56.9 R37.2 22.15,56.69 22.15,45.52 23.16,44.5 23.16,42.67 22.15,41.66 R38.2 | R34.2 14.63,26.01 16.46,26.01 17.68,24.79 20.52,24.79 21.95,26.21 R39.2 | v13.61,16.46 10.57,13.41 R2.2 | 44.3,56.9 47.35,56.9 R6.2 | 44.3,56.9 42.47,56.9 R12.2 | R14.2 42.47,26.42 42.47,27.43 43.48,28.45 43.48,40.44 42.47,41.45 R13.2 42.47,41.66 44.3,43.48 44.3,56.9 | R9.2 17.88,71.73 21.74,71.73 21.95,71.93 R36.2 | R3.2 18.09,86.97 20.73,86.97 21.54,86.16 36.17,86.16 37.19,87.17 R16.2
N$41
  Top 0.254: R20.1 37.19,13.61 32.31,13.61 R26.1 32.11,13.61 27.23,13.61 R32.1 27.03,13.61 26.42,13.61 23.98,11.18 20.93,11.18 18.9,13.21 18.29,13.21 R27.1 | R19.1 37.19,28.85 32.31,28.85 R25.1 32.11,28.85 27.23,28.85 R31.1 | R35.1 22.15,74.57 27.03,74.57 R28.1 | R30.1 27.23,44.09 32.11,44.09 R24.1 32.31,44.09 37.19,44.09 R18.1 | R29.1 27.23,59.33 32.11,59.33 R23.1 32.31,59.33 37.19,59.33 R17.1
  Bottom 0.254: R21.1 18.29,28.85 20.52,28.85 22.15,30.48 25.6,30.48 27.03,29.06 R31.1 27.23,28.85 28.65,27.43 28.65,23.37 32.11,19.91 32.11,13.82 R26.1 | 31.09,74.57 27.23,74.57 R28.1 | 31.09,74.57 32.11,74.57 R22.1 | R24.1 32.31,44.3 32.31,55.27 33.33,56.29 33.33,58.32 32.31,59.33 R23.1 32.11,59.54 31.09,60.55 31.09,74.57 | R19.1 37.19,29.06 37.19,30.68 36.17,31.7 36.17,43.08 37.19,44.09 R18.1
N$42
  Top 0.254: R34.1 14.63,13.21 16.66,13.21 19.1,10.77 24.18,10.77 24.38,10.97 48.16,10.97 51.21,7.92 A1.5V_2
N$43  (via drill 0.35)
  Top 0.254: v30.28,63.4 41.45,74.57 42.27,74.57 R10.1 | v21.34,12.6 19.71,14.22 19.71,17.07 15.65,21.13 15.65,26.42 14.43,27.64 12.8,27.64 9.75,30.68 J1.19
  Bottom 0.254: v30.28,63.4 30.28,41.86 24.38,35.97 16.05,35.97 14.63,34.54 10.16,34.54 9.96,34.75 9.14,34.75 8.33,33.93 8.33,32.11 9.55,30.89 J1.19 | v21.34,12.6 20.93,13.01 20.93,14.02 21.74,14.83 22.35,14.83 23.77,13.41 23.77,9.96 25.81,7.92 A1.40
N$44  (via drill 0.35)
  Top 0.254: v41.25,73.15 41.25,71.53 42.27,70.51 42.27,59.54 R11.1 | v22.96,12.39 23.57,12.39 31.9,20.73 v36.98,20.73
  Bottom 0.254: v41.25,73.15 39.62,74.78 39.62,74.98 32.72,81.89 7.72,81.89 5.49,79.65 5.49,77.83 6.71,76.61 J1.21 | v22.96,12.39 23.37,11.99 23.37,7.92 A1.42 | v36.98,20.73 39.83,23.57 39.83,41.05 39.62,41.25 39.62,44.09 43.89,48.36 43.89,53.65 41.25,56.29 41.25,58.32 42.27,59.33 R11.1
N$45
  Top 0.254: A1.GND5 8.13,5.49 8.13,7.72 A1.GND4 8.13,7.92 8.13,9.14 5.69,11.58 5.69,28.45 GND.MP
N$48  (via drill 0.35)
  Top 0.254: 18.09,48.36 18.09,49.78 18.49,50.19 40.64,50.19 44.7,46.13 51.21,46.13 A1.3 | 18.09,48.36 18.09,47.55 21.34,44.3 21.95,44.3 R37.1 | v13.41,44.5 13.41,45.52 16.26,48.36 18.09,48.36
  Bottom 0.254: v13.41,44.5 12.19,43.28 9.35,43.28 8.33,42.27 8.33,42.06 6.91,40.64 J1.34

### Text on the board
tNames: GND | VCC | DIO | CLK | 1 | 20 | 2 | 21 | MEGA 2560 SHIELD / / CEK PIN MAX 37 POINT / V2024.07.25 / / Created & Design By : AGUS F / PT HARMONICS TECHINDO AGUNG | 3 | 22 | 4 | 23 | 5 | 24 | 25 | 6 | 7 | 26 | 8 | 27 | 9 | 28 | 10 | 29 | 11 | 30 | 12 | 31 | 13 | 32 | 14 | 33 | 15 | 34 | 16 | 35 | 17 | 36 | 18 | 37 | 19